# Altium schematic sheet Led-3V.SchDoc
size A
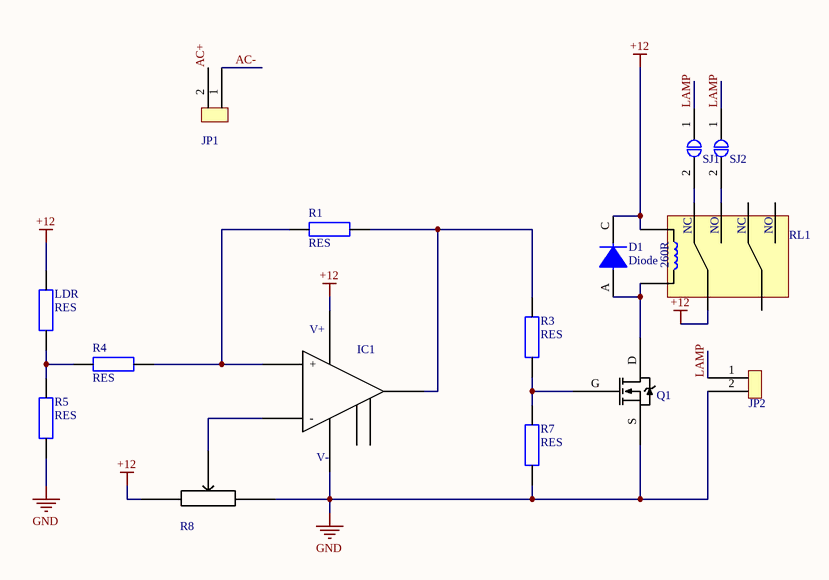
[diagram p0: Led-3V.SchDoc]

## Parts
D1  Diode  [DIODE - VERTICAL]
IC1  lm741-2  [LM741]  (value not drawn)
JP1  JP_2  [JP_2]  (value not drawn)
JP2  JP_2  [JP_2]  (value not drawn)
LDR  RES  [RES_VERTICAL]
Q1  IRF640  [IRF640]  (value not drawn)
R1  RES  [RES_VERTICAL]
R3  RES  [RES_VERTICAL]
R4  RES  [RES_VERTICAL]
R5  RES  [RES]
R7  RES  [RES_VERTICAL]
R8  POT_RES  [POT_2]  (value not drawn)
RL1  RYxW-K  [RYxW-K]  (value not drawn)
SJ1  Solderable Jump  [S_JP_1]  (value not drawn)
SJ2  Solderable Jump  [S_JP_1]  (value not drawn)

## Nets
+12: D1.C IC1.7(V+) LDR.1 R8.1 RL1.1 RL1.2(COM)
GND: IC1.4(V-) JP2.2 Q1.S R5.1 R7.1 R8.3
AC+: JP1.2
AC-: JP1.1
LAMP: JP2.1 SJ1.1 SJ2.1
NetD1_A: D1.A Q1.D RL1.8
NetIC1_2: IC1.2(-) R8.2
NetIC1_3: IC1.3(+) R1.1 R4.2
NetIC1_6: IC1.6(Out) R1.2 R3.2
NetLDR_2: LDR.2 R4.1 R5.2
NetQ1_G: Q1.G R3.1 R7.2
NetRL1_3: RL1.3 SJ1.2
NetRL1_4: RL1.4 SJ2.2

Not connected (* = marked no-connect by the designer): IC1 1; RL1 5 6 7

## Notes on the sheet
- Title
- Size:
- Date:
- A
- Number:
- Time:
- Revision:
- Sheet
- of
- File:
- (in symbol RYxW-K) NC; NO; 260R

## Library data of the parts
LDR R1 R3-R5 R7 = RES: điện trở size nhỏ
Q1 = IRF640: Transistor MOSFET N-channel
R8 = POT_RES: Potentiometer